# Altium schematic sheet RADG-Power-S03-V00.SchDoc: RADG Power (Filtering, Power Sequencing, USB)
size A3; DrawnBy: Jonn Dillon; DocumentNumber: 3; SheetNumber: 5; SheetTotal: 6; Version: 00; Project: QUTMS RADIO GPS; PageSetup: Record=PageOptions|CenterHorizontal=True|CenterVertical=True|PrintScale=0.97|XCorrection=1.00|YCorrection=1.00|PrintKind=0|BorderSize=5000000|LeftOffset=0|BottomOffset=0|Orientation=2|PaperLength=1000|PaperWidth=1000|Scale=100|PaperSource=7|PrintQuality=-4|MediaType=1|DitherType=10|PaperKind=A4|PrintScaleMode=1
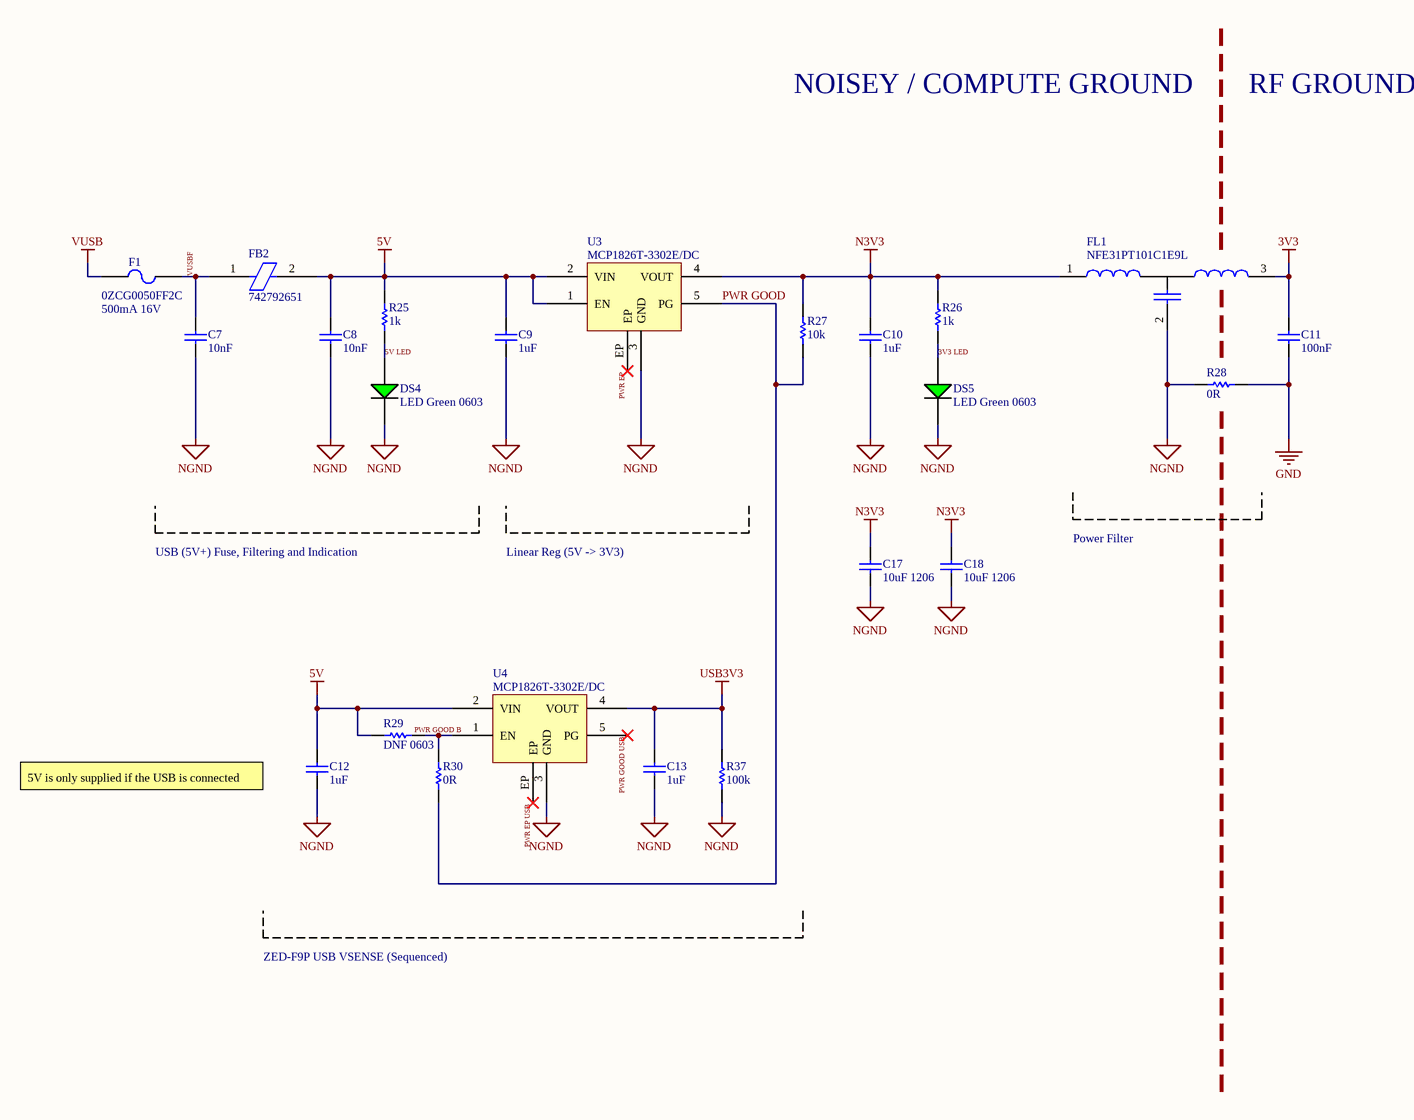
[diagram p0: RADG-Power-S03-V00.SchDoc]

## Parts
C7  10nF  [Cap_Ceramic_0603]
C8  10nF  [Cap_Ceramic_0603]
C9  1uF  [Cap_Ceramic_0603]
C10  1uF  [Cap_Ceramic_0603]
C11  100nF  [Cap_Ceramic_0603]
C12  1uF  [Cap_Ceramic_0603]
C13  1uF  [Cap_Ceramic_0603]
C17  10uF 1206  [Cap_Ceramic_1206]
C18  10uF 1206  [Cap_Ceramic_1206]
DS4  LED Green 0603  [LED GREEN 0603]
DS5  LED Green 0603  [LED GREEN 0603]
F1  0ZCG0050FF2C  [1812 FUSE]
FB2  742792651  [Inductor_0603]
FL1  NFE31PT101C1E9L  [NFE31PT101C1E9L]
R25  1k  [Res_ThinFilm_0603]
R26  1k  [Res_ThinFilm_0603]
R27  10k  [Res_ThinFilm_0603]
R28  0R  [Res_ThinFilm_0603]
R29  DNF 0603  [Res_ThinFilm_0603]
R30  0R  [Res_ThinFilm_0603]
R37  100k  [Res_ThinFilm_0603]
U3  MCP1826T-3302E/DC  [SOT-223-5]
U4  MCP1826T-3302E/DC  [SOT-223-5]

## Nets
3V3: C11.2 FL1.3
5V: C8.2 C9.2 C12.2 FB2.2 R25.2 R29.1 U3.1(EN) U3.2(VIN) U4.2(VIN)
GND: C11.1 R28.2
N3V3: C10.2 C17.2 C18.2 FL1.1 R26.2 R27.2 U3.4(VOUT)
NGND: C7.1 C8.1 C9.1 C10.1 C12.1 C13.1 C17.1 C18.1 DS4.2(C) DS5.2(C) FL1.2 R28.1 R37.1 U3.3(GND) U4.3(GND)
USB3V3: C13.2 R37.2 U4.4(VOUT)
VUSB: F1.1
3V3 LED: DS5.1(A) R26.1
5V LED: DS4.1(A) R25.1
PWR EP: U3.EP
PWR EP USB: U4.EP
PWR GOOD: R27.1 R30.1 U3.5(PG)
PWR GOOD B: R29.2 R30.2 U4.1(EN)
PWR GOOD USB: U4.5(PG)
VUSBF: C7.2 F1.2 FB2.1

## Notes on the sheet
- NOISEY / COMPUTE GROUND
- RF GROUND
- 500mA 16V
- USB (5V+) Fuse, Filtering and Indication
- Linear Reg (5V -> 3V3)
- Power Filter
- 5V is only supplied if the USB is connected
- ZED-F9P USB VSENSE (Sequenced)
- Revision History:
- Sheet Title:
- Rev
- Date
- Description
- Project:
- Size:
- Drawn By:
- A3
- Number:
- Revision:
- Sheet
- Version:
- of
- QUT Motorsport
- O-120, Gardens Point
- 2 George Street
- Brisbane, QLD 4000
- Australia
- Print Date:
- Print Time:
- File Name:

## Library data of the parts
C7 C8 = 10nF 50V 5% X7R 0603: Capacitor, Ceramic, SMD, 10nF, 50V, 5%, X7R, 0603
C9 C10 C12 C13 = 1uF 25V 5% X7R 0603: Capacitor, Ceramic, SMD, 1uF, 25V, 5%, X7R, 0603
C11 = 100nF 50V 5% X7R 0603: Capacitor, Ceramic, SMD, 100nF, 50V, 5%, X7R, 0603
C17 C18 = 10uF 25V 10% X7R 1206: Capacitor, Ceramic, SMD, 10uF, 25V, 10%, X7R, 1206
F1 = 0ZCG0050FF2C: Polymeric PTC Resettable Fuse 16V 500mA Ih Surface Mount 1812 (4532 Metric), Concave
FB2 = 742792651: 600 Ohms @ 100MHz 1 Signal Line Ferrite Bead 0603 (1608 Metric) 1A 200mOhm
FL1 = NFE31PT101C1E9L: LC (T-Type) EMI Filter 3rd Order Low Pass 1 Channel C = 100pF 6A 1206 (3216 Metric), 3 PC Pad
R25 R26 = 1k 5% 0603: Resistor, SMD, 1k, 0.1W, 5%, 0603
R27 = 10k 5% 0603: Resistor, SMD, 10k, 0.1W, 5%, 0603
R28 R30 = 0R 5% 0603: Resistor, SMD, 0R, 0.1W, 5%, 0603
R29 = DNF 0603: Resistor, SMD, DNF, 0.1W, 0603
R37 = 100k 5%, 0603: Resistor, SMD, 100k, 0.1W, 5%, 0603
U3 U4 = MCP1826T-3302E/DC: Linear Voltage Regulator IC Positive Fixed 1 Output 1A SOT-223-5